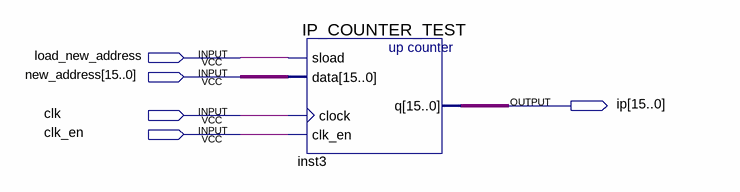
[diagram p0: schematic sheet]
// Quartus schematic IP_TEST.bdf as structural Verilog: 1 symbols, 5 pins
module IP_TEST (
  input  load_new_address,
  input  [15:0] new_address,
  input  clk,
  input  clk_en,
  output [15:0] ip
);

  IP_COUNTER_TEST inst3 (.sload(load_new_address), .data(new_address), .clock(clk), .clk_en(clk_en), .q(ip));
endmodule
